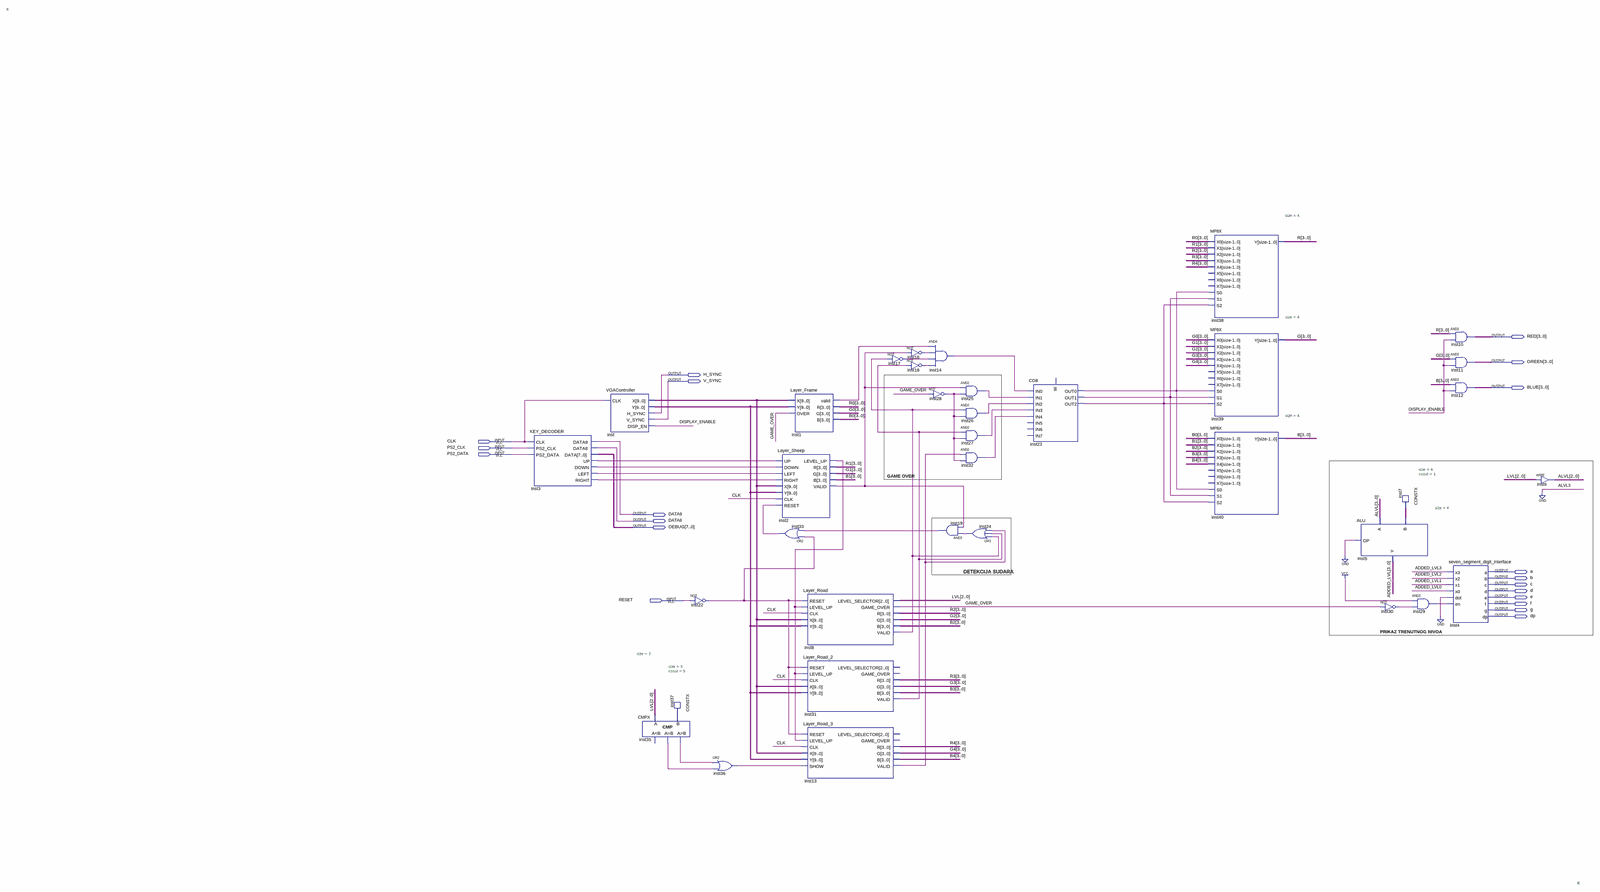
[diagram p0: schematic sheet, whole]
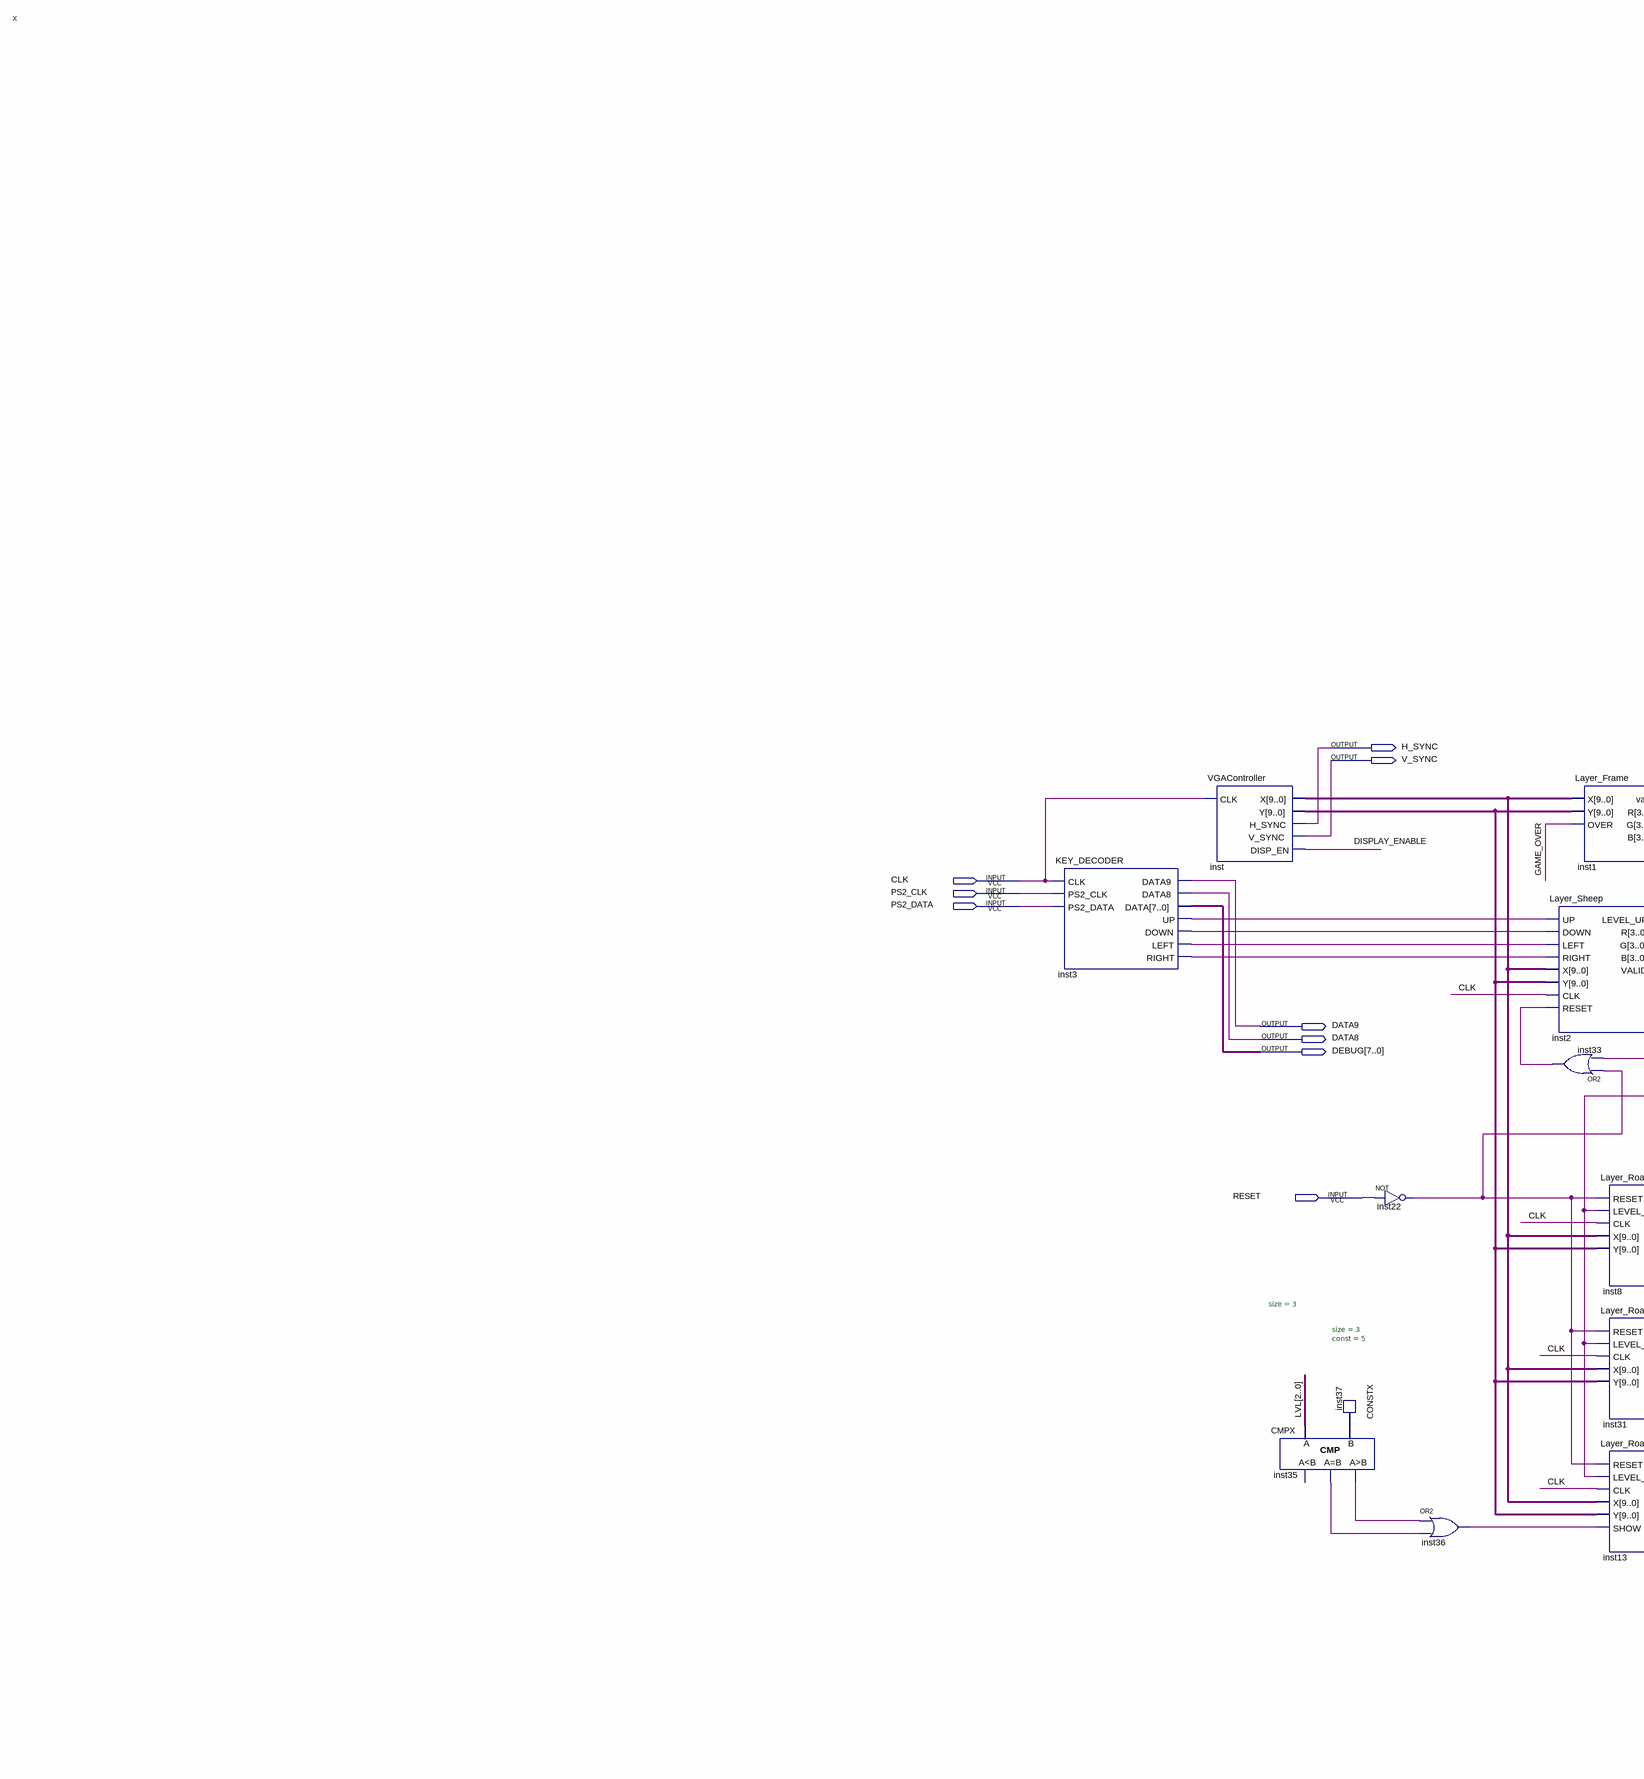
[diagram p1: schematic sheet, left part]
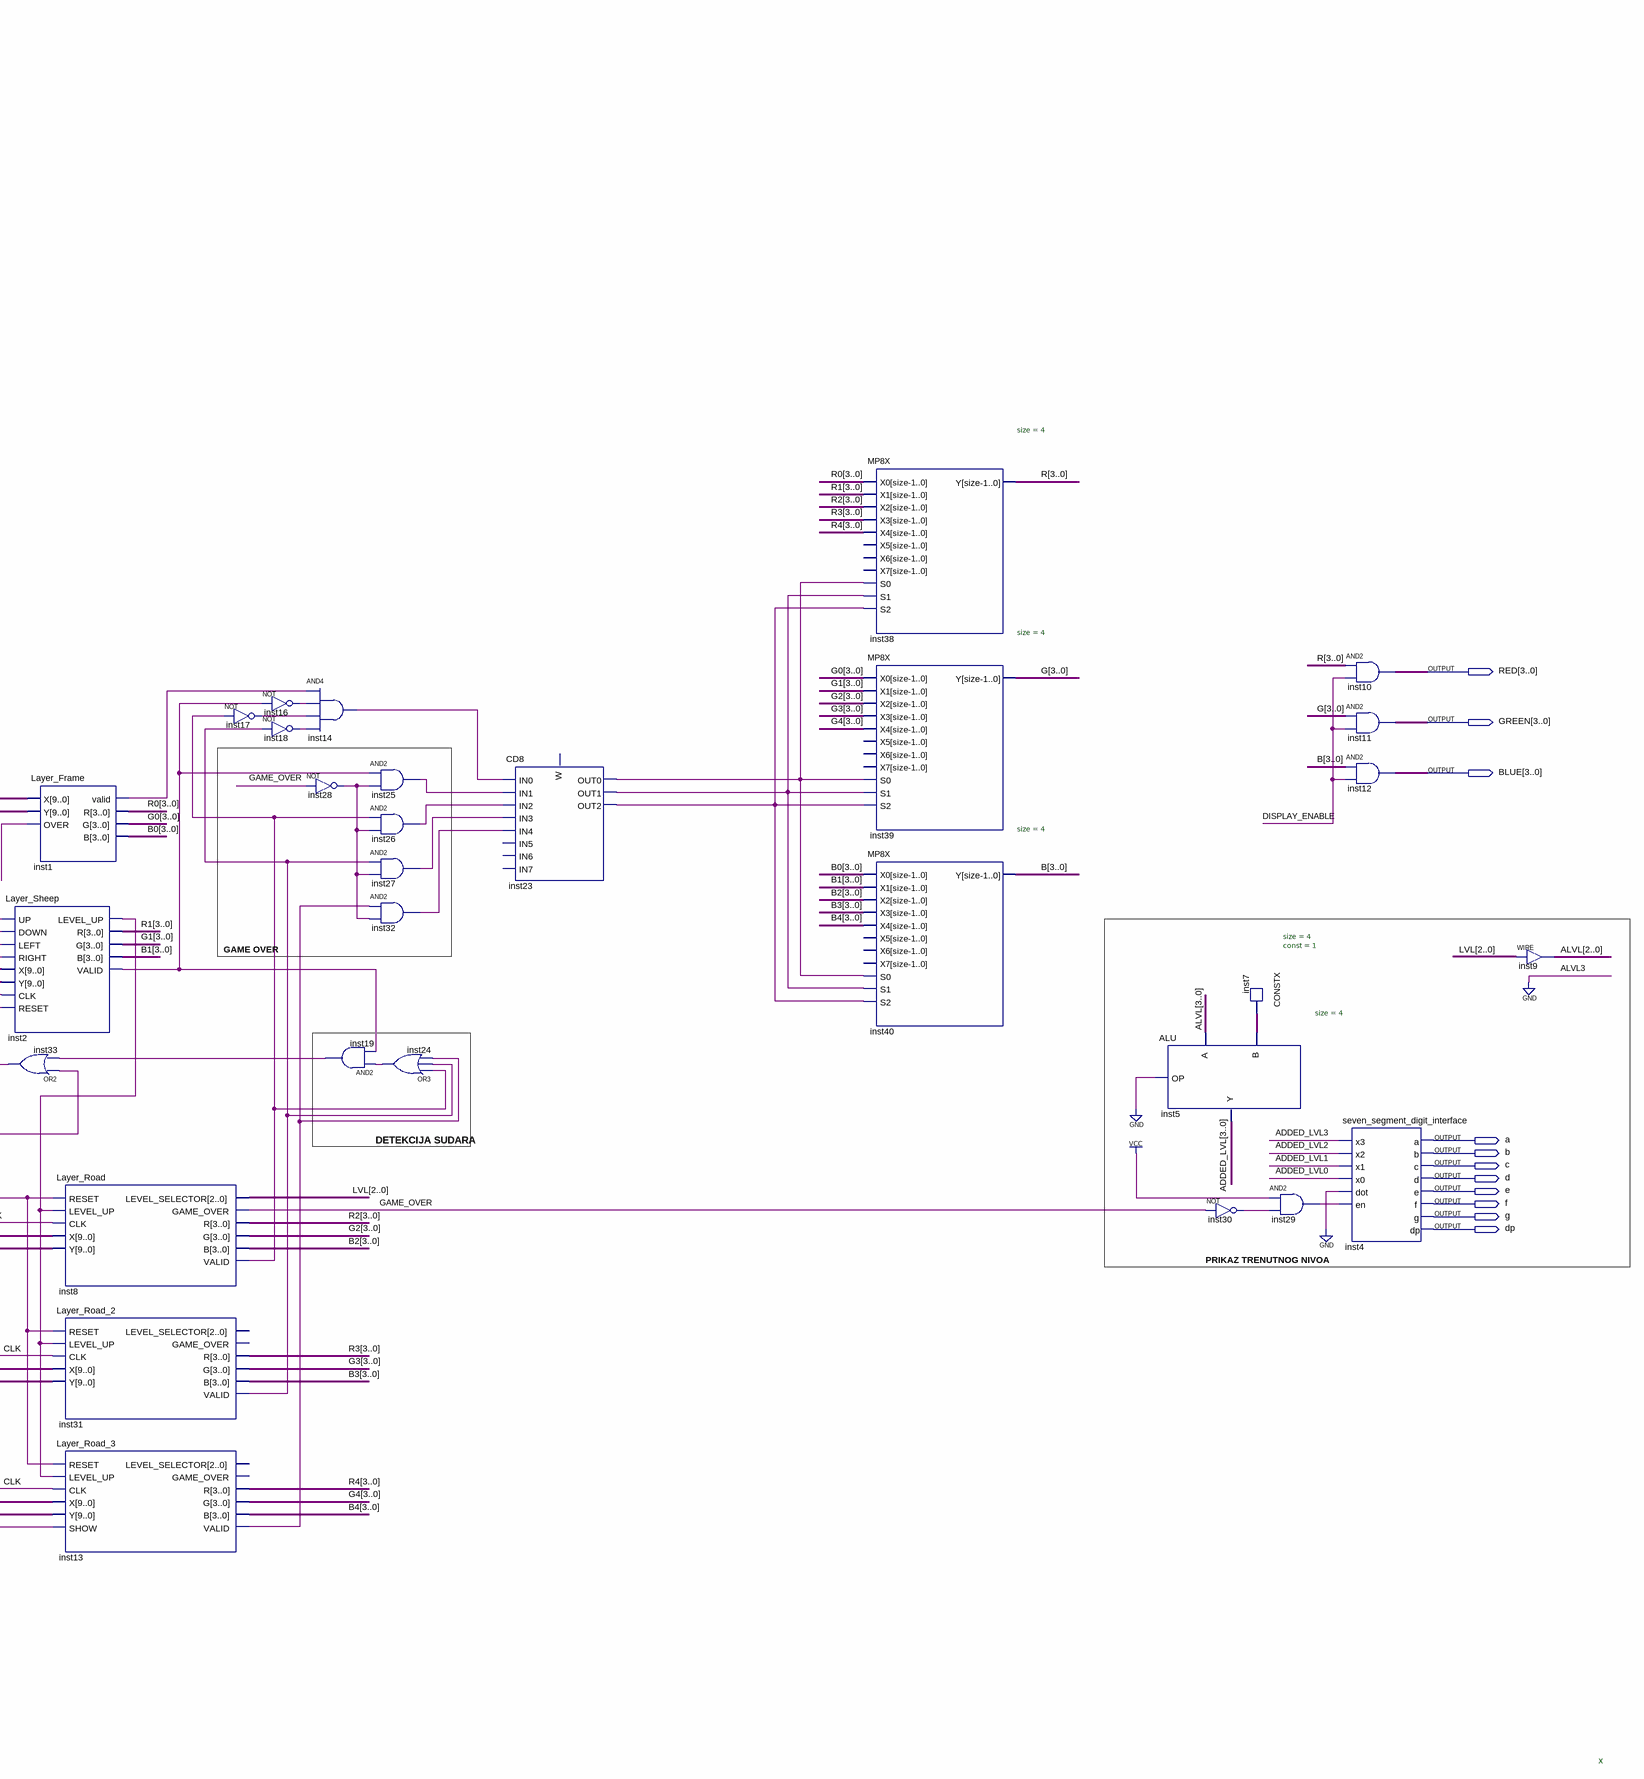
[diagram p2: schematic sheet, right part]
// Quartus schematic ORT2.bdf as structural Verilog: 36 symbols, 20 pins
module ORT2 (
  input  CLK,
  input  PS2_CLK,
  input  PS2_DATA,
  input  RESET,
  output [3:0] RED,
  output [3:0] GREEN,
  output H_SYNC,
  output V_SYNC,
  output [3:0] BLUE,
  output DATA9,
  output DATA8,
  output [7:0] DEBUG,
  output a,
  output b,
  output c,
  output d,
  output e,
  output f,
  output g,
  output dp
);

  wire DISPLAY_ENABLE, GAME_OVER, inst1_valid, inst2_level_up, inst2_valid, inst3_down, inst3_left,
       inst3_right, inst3_up, inst8_valid, inst13_valid, inst14_out, inst16_out, inst17_out, inst18_out,
       inst19_out, inst22_out, inst23_out0, inst23_out1, inst23_out2, inst24_out, inst25_out, inst26_out,
       inst27_out, inst28_out, inst29_out, inst30_out, inst31_valid, inst32_out, inst33_out, inst35_eq,
       inst35_gr, inst36_out;
  wire [2:0] ALVL, inst37_data, LVL;
  wire [3:0] ADDED_LVL, B0, B1, B2, B3, B4, b_bus, G0, G1, G2, G3, G4, g_bus, inst7_data, R, R0, R1, R2, R3,
       R4;
  wire [9:0] inst_x, inst_y;

  KEY_DECODER inst3 (
    .CLK(CLK), .PS2_CLK(PS2_CLK), .PS2_DATA(PS2_DATA), .DATA9(DATA9), .DATA8(DATA8), .DATA(DEBUG),
    .UP(inst3_up), .DOWN(inst3_down), .LEFT(inst3_left), .RIGHT(inst3_right));
  VGAController inst (.CLK(CLK), .X(inst_x), .Y(inst_y), .H_SYNC(H_SYNC), .V_SYNC(V_SYNC), .DISP_EN(DISPLAY_ENABLE));
  CMPX #(.size(3)) inst35 (.A(LVL), .B(inst37_data), .eq(inst35_eq), .gr(inst35_gr));  // open: ls
  CONSTX #(.size(3), .\const (5)) inst37 (.data(inst37_data));
  not inst22 (inst22_out, RESET);
  or inst36 (inst36_out, inst35_gr, inst35_eq);
  Layer_Sheep inst2 (
    .UP(inst3_up), .DOWN(inst3_down), .LEFT(inst3_left), .RIGHT(inst3_right), .X(inst_x), .Y(inst_y),
    .CLK(CLK), .RESET(inst33_out), .LEVEL_UP(inst2_level_up), .R(R1), .G(G1), .B(B1), .VALID(inst2_valid));
  Layer_Frame inst1 (.X(inst_x), .Y(inst_y), .OVER(GAME_OVER), .valid(inst1_valid), .R(R0), .G(G0), .B(B0));
  or inst33 (inst33_out, inst22_out, inst19_out);
  Layer_Road inst8 (
    .RESET(inst22_out), .LEVEL_UP(inst2_level_up), .CLK(CLK), .X(inst_x), .Y(inst_y), .LEVEL_SELECTOR(LVL),
    .GAME_OVER(GAME_OVER), .R(R2), .G(G2), .B(B2), .VALID(inst8_valid));
  Layer_Road_2 inst31 (
    .RESET(inst22_out), .LEVEL_UP(inst2_level_up), .CLK(CLK), .X(inst_x), .Y(inst_y), .R(R3), .G(G3), .B(B3),
    .VALID(inst31_valid));  // open: LEVEL_SELECTOR, GAME_OVER
  Layer_Road_3 inst13 (
    .RESET(inst22_out), .LEVEL_UP(inst2_level_up), .CLK(CLK), .X(inst_x), .Y(inst_y), .SHOW(inst36_out),
    .R(R4), .G(G4), .B(B4), .VALID(inst13_valid));  // open: LEVEL_SELECTOR, GAME_OVER
  not inst17 (inst17_out, inst8_valid);
  and inst14 (inst14_out, inst1_valid, inst16_out, inst17_out, inst18_out);
  not inst16 (inst16_out, inst2_valid);
  not inst18 (inst18_out, inst31_valid);
  not inst28 (inst28_out, GAME_OVER);
  and inst19 (inst19_out, inst24_out, inst2_valid);
  and inst25 (inst25_out, inst2_valid, inst28_out);
  and inst26 (inst26_out, inst8_valid, inst28_out);
  and inst27 (inst27_out, inst31_valid, inst28_out);
  and inst32 (inst32_out, inst13_valid, inst28_out);
  or inst24 (inst24_out, inst8_valid, inst31_valid, inst13_valid);
  CD8 inst23 (
    .IN0(inst14_out), .IN1(inst25_out), .IN2(inst26_out), .IN3(inst27_out), .IN4(inst32_out),
    .OUT0(inst23_out0), .OUT1(inst23_out1), .OUT2(inst23_out2));  // open: IN5, IN6, IN7, W
  MP8X #(.size(4)) inst38 (
    .X0(R0), .X1(R1), .X2(R2), .X3(R3), .X4(R4), .S0(inst23_out0), .S1(inst23_out1), .S2(inst23_out2), .Y(R));  // open: X5, X6, X7
  MP8X #(.size(4)) inst39 (
    .X0(G0), .X1(G1), .X2(G2), .X3(G3), .X4(G4), .S0(inst23_out0), .S1(inst23_out1), .S2(inst23_out2),
    .Y(g_bus));  // open: X5, X6, X7
  MP8X #(.size(4)) inst40 (
    .X0(B0), .X1(B1), .X2(B2), .X3(B3), .X4(B4), .S0(inst23_out0), .S1(inst23_out1), .S2(inst23_out2),
    .Y(b_bus));  // open: X5, X6, X7
  ALU #(.size(4)) inst5 (.op(1'b0), .a({1'b0, ALVL}), .b(inst7_data), .result(ADDED_LVL));
  not inst30 (inst30_out, GAME_OVER);
  CONSTX #(.size(4), .\const (1)) inst7 (.data(inst7_data));
  and inst29 (inst29_out, 1'b1, inst30_out);
  assign RED = R & {4{DISPLAY_ENABLE}};  // AND2 inst10, 4 bits wide
  assign GREEN = g_bus & {4{DISPLAY_ENABLE}};  // AND2 inst11, 4 bits wide
  assign BLUE = b_bus & {4{DISPLAY_ENABLE}};  // AND2 inst12, 4 bits wide
  seven_segment_digit_interface inst4 (
    .x3(ADDED_LVL[3]), .x2(ADDED_LVL[2]), .x1(ADDED_LVL[1]), .x0(ADDED_LVL[0]), .dot(1'b0), .en(inst29_out),
    .a(a), .b(b), .c(c), .d(d), .e(e), .f(f), .g(g), .dp(dp));
  assign ALVL = LVL;  // WIRE inst9

  // Notes on the sheet:
  //   x
  //   GAME OVER
  //   DETEKCIJA SUDARA
  //   PRIKAZ TRENUTNOG NIVOA
  //   x
endmodule
